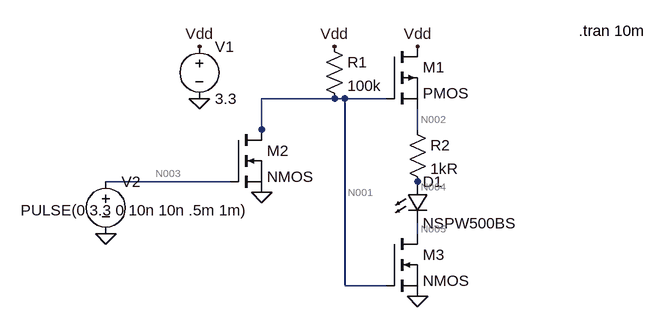
[diagram p0: schematic ledArray.asc]
ledArray.asc, the LTspice schematic file:
Version 4
SHEET 1 880 680
WIRE 80 128 -32 128
WIRE 96 128 80 128
WIRE 160 128 96 128
WIRE -32 176 -32 128
WIRE 208 176 208 144
WIRE -32 192 -32 176
WIRE -80 256 -272 256
WIRE 208 272 208 256
WIRE 208 336 208 320
WIRE 96 416 96 128
WIRE 160 416 96 416
FLAG 208 48 Vdd
FLAG -128 48 Vdd
FLAG -128 128 0
FLAG -32 272 0
FLAG 80 48 Vdd
FLAG 208 432 0
FLAG -272 336 0
SYMBOL pmos 160 48 R0
SYMATTR InstName M1
SYMBOL voltage -128 32 R0
WINDOW 123 0 0 Left 2
WINDOW 39 0 0 Left 2
SYMATTR InstName V1
SYMATTR Value 3.3
SYMBOL voltage -272 240 R0
WINDOW 3 -131 60 Left 2
WINDOW 123 0 0 Left 2
WINDOW 39 0 0 Left 2
SYMATTR InstName V2
SYMATTR Value PULSE(0 3.3 0 10n 10n .5m 1m)
SYMBOL LED 192 256 R0
SYMATTR InstName D1
SYMATTR Value NSPW500BS
SYMBOL res 64 32 R0
SYMATTR InstName R1
SYMATTR Value 100k
SYMBOL nmos -80 176 R0
SYMATTR InstName M2
SYMBOL res 192 160 R0
SYMATTR InstName R2
SYMATTR Value 1kR
SYMBOL nmos 160 336 R0
SYMATTR InstName M3
TEXT 456 24 Left 2 !.tran 10m

The netlist it stands for:
* ledArray.asc
M1 Vdd N001 N002 N002 PMOS
V1 Vdd 0 3.3
V2 N003 0 PULSE(0 3.3 0 10n 10n .5m 1m)
D1 N004 N005 NSPW500BS
R1 Vdd N001 100k
M2 N001 N003 0 0 NMOS
R2 N002 N004 1kR
M3 N005 N001 0 0 NMOS
.model D D
.lib standard.dio
.model NMOS NMOS
.model PMOS PMOS
.lib standard.mos
.tran 10m
.backanno
.end

* Results of the author's LTspice run, read from the files saved beside the schematic
* Operating Point, zero values left out:
*   V(vdd) = 3.3 V
*   V(n001) = 3.3 V
*   V(n002) = 2.73 V
*   V(n004) = 2.693 V
*   V(n005) = 616.4 mV
*   Id(M3) = 36.88 µA
*   Is(M3) = -36.88 µA
*   Id(M2) = 6.61 pA
*   Ib(M2) = -3.31 pA
*   Is(M2) = -3.3 pA
*   Id(M1) = 36.88 µA
*   Ib(M1) = -36.88 µA
*   I(D1) = 36.88 µA
*   I(R2) = 36.88 µA
*   I(R1) = 6.61 pA
*   I(V1) = -36.88 µA
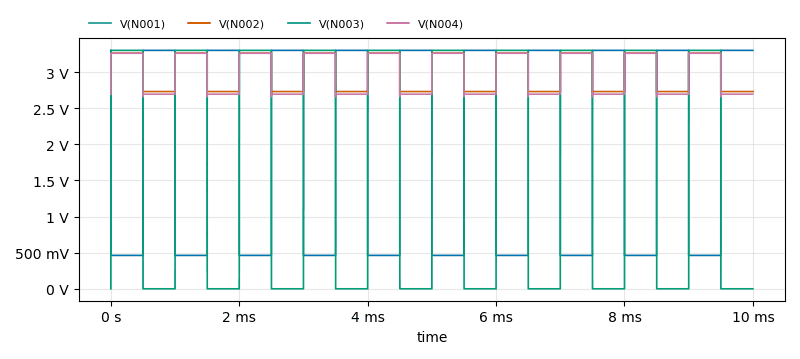
[diagram p1: Transient Analysis of ledArray.asc, plotted from the saved traces]
* Transient Analysis, 1 run:
*   V(N001): min 462.3 mV, max 3.3 V, average 1.881 V, rms 2.356 V, last 3.3 V
*   V(N002): min 2.718 V, max 3.262 V, average 2.996 V, rms 3.008 V, last 2.73 V
*   V(N003): min 0 V, max 3.3 V, average 1.65 V, rms 2.333 V, last 0 V
*   V(N004): min 2.658 V, max 3.26 V, average 2.977 V, rms 2.99 V, last 2.693 V